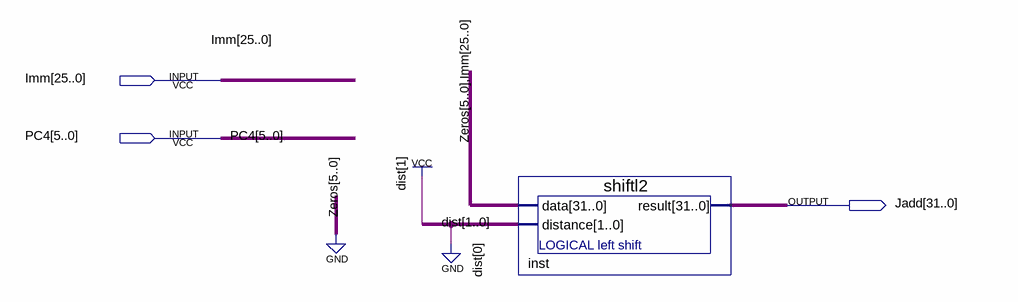
[diagram p0: schematic sheet]
// Quartus schematic CalcJadd.bdf as structural Verilog: 1 symbols, 3 pins
module CalcJadd (
  input  [25:0] Imm,
  input  [5:0] PC4,
  output [31:0] Jadd
);

  shiftl2 inst (.data({{6{1'b0}}, Imm}), .distance(2'b10), .result(Jadd));
endmodule
